# Altium project X98_CARRIER_V1R2.PrjPcb (part 3 of 3)

## Sheet 04 Custom.SchDoc
size A3; SheetNumber: 3; SheetTotal: 15; SPICEModelCacheQCWDKNHH: <root> / <DocumentId>QCWDKNHH</DocumentId> / <CacheFrame Number="0"> / <Model Name="pnp" Kind="MDL"> / <Text>*Default PNP BJT / *PNP Trans Pinout: C,B,E / .MODEL PNP PNP()</Text> / </Model> / </CacheFrame> / </root>
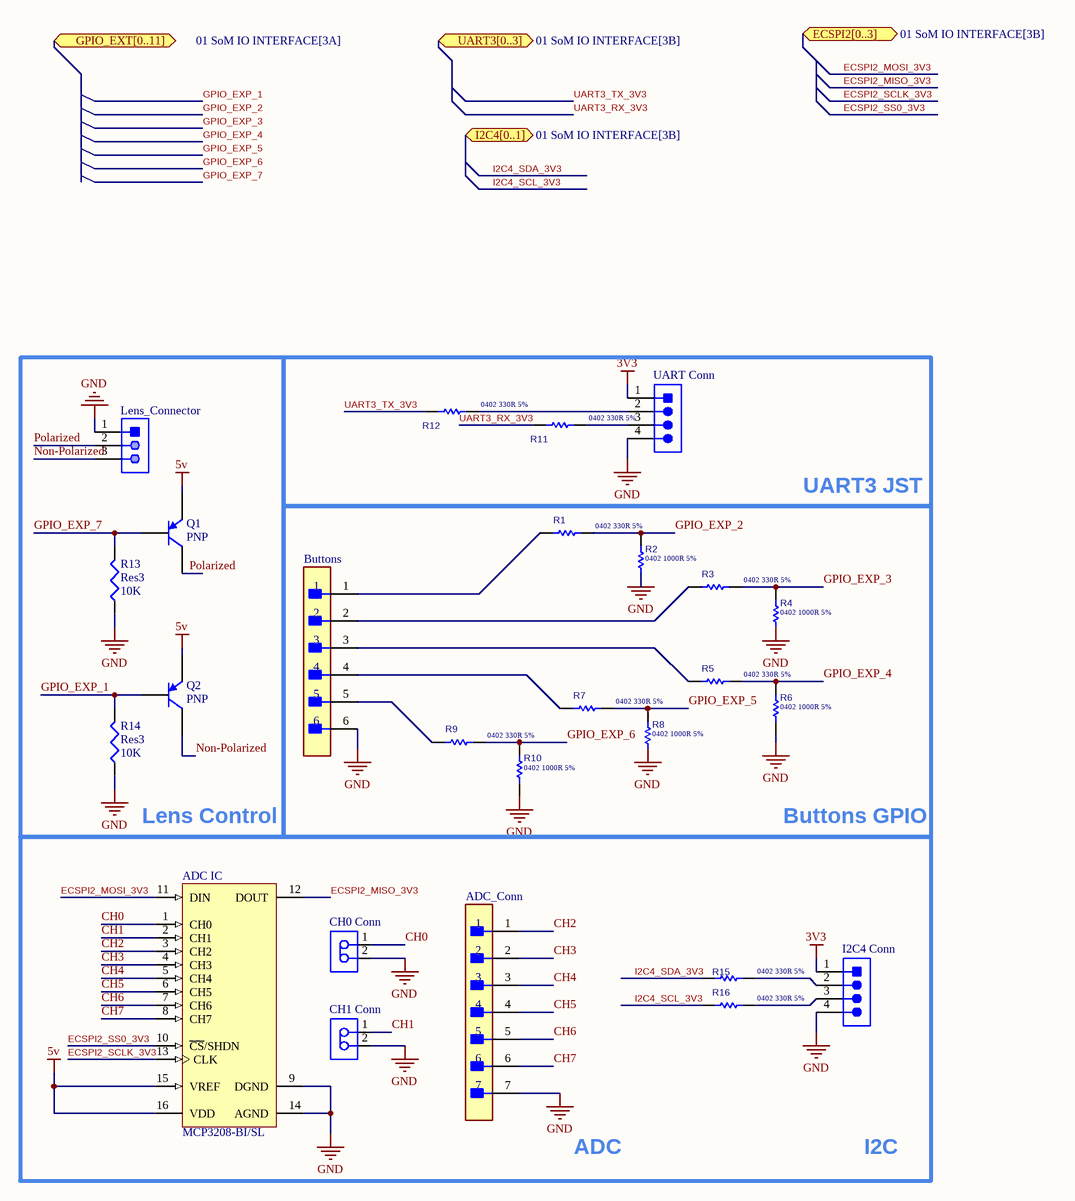
[diagram p13: 04 Custom.SchDoc]

### Parts
ADC_Conn  S7B-PH-K-S(LF)(SN)  [FP-S7B-PH-K-S_LF_SN-MFG]  (value not drawn)
ADC_IC  MCP3208-BI/SL  [SOIC-SL16_L]
Buttons  S6B-ZR(LF)(SN)  [FP-S6B-ZR_LF_SN-MFG]  (value not drawn)
CH0_Conn  B2B-PH-K-S(LF)(SN)  [JST-B2B-PH-K-S_V]  (value not drawn)
CH1_Conn  B2B-PH-K-S(LF)(SN)  [JST-B2B-PH-K-S_V]  (value not drawn)
I2C4_Conn  B4B-PH-K-S(LF)(SN)  [JST-B4B-PH-K-S_V]  (value not drawn)
Lens_Connector  B3B-PH-K-S(LF)(SN)  [JST-B3B-PH-K-S-3_V]  (value not drawn)
Q1  PNP  [SOT-23B_N]
Q2  PNP  [SOT-23B_N]
R1  0402 330R 5%  [0402_RES]
R2  0402 1000R 5%  [0402_RES]
R3  0402 330R 5%  [0402_RES]
R4  0402 1000R 5%  [0402_RES]
R5  0402 330R 5%  [0402_RES]
R6  0402 1000R 5%  [0402_RES]
R7  0402 330R 5%  [0402_RES]
R8  0402 1000R 5%  [0402_RES]
R9  0402 330R 5%  [0402_RES]
R10  0402 1000R 5%  [0402_RES]
R11  0402 330R 5%  [0402_RES]
R12  0402 330R 5%  [0402_RES]
R13  Res3  value 10K  [J1-0603]
R14  Res3  value 10K  [J1-0603]
R15  0402 330R 5%  [0402_RES]
R16  0402 330R 5%  [0402_RES]
UART_Conn  B4B-PH-K-S(LF)(SN)  [JST-B4B-PH-K-S_V]  (value not drawn)

### Blocks framed on the sheet
Lens Control: Lens_Connector Q1 Q2 R13 R14
UART3 JST: R11 R12 UART_Conn
Buttons GPIO: Buttons R1-R10

### Ports
ECSPI2[0..3] (bidir, see 01 SoM IO INTERFACE[3B]), GPIO_EXT[0..11] (bidir, see 01 SoM IO INTERFACE[3A]), I2C4[0..1] (bidir, see 01 SoM IO INTERFACE[3B]), UART3[0..3] (bidir, see 01 SoM IO INTERFACE[3B])

### Nets
3V3: I2C4_Conn.1 UART_Conn.1
5v: ADC_IC.15(VREF) ADC_IC.16(VDD) Q1.3(E) Q2.3(E)
GND: ADC_Conn.7 ADC_IC.9(DGND) ADC_IC.14(AGND) Buttons.6 CH0_Conn.2 CH1_Conn.2 I2C4_Conn.4 Lens_Connector.1 R2.1 R6.1 R10.1 R13.1 R14.1 UART_Conn.4
CH0: ADC_IC.1(CH0) CH0_Conn.1
CH1: ADC_IC.2(CH1) CH1_Conn.1
CH2: ADC_Conn.1 ADC_IC.3(CH2)
CH3: ADC_Conn.2 ADC_IC.4(CH3)
CH4: ADC_Conn.3 ADC_IC.5(CH4)
CH5: ADC_Conn.4 ADC_IC.6(CH5)
CH6: ADC_Conn.5 ADC_IC.7(CH6)
CH7: ADC_Conn.6 ADC_IC.8(CH7)
ECSPI2_MISO_3V3: ADC_IC.12(DOUT)
ECSPI2_MOSI_3V3: ADC_IC.11(DIN)
ECSPI2_SCLK_3V3: ADC_IC.13(CLK)
ECSPI2_SS0_3V3: ADC_IC.10(~{CS}/SHDN)
GPIO_EXP_1: Q2.2(B) R14.2
GPIO_EXP_2: R1.2 R2.2
GPIO_EXP_3: R3.2 R4.2
GPIO_EXP_4: R5.2 R6.2
GPIO_EXP_5: R7.2 R8.2
GPIO_EXP_6: R9.2 R10.2
GPIO_EXP_7: Q1.2(B) R13.2
I2C4_SCL_3V3: R16.1
I2C4_SDA_3V3: R15.1
Non-Polarized: Lens_Connector.3 Q2.1(C)
Polarized: Lens_Connector.2 Q1.1(C)
UART3_RX_3V3: R11.1
UART3_TX_3V3: R12.1
NetButtons_1: Buttons.1 R1.1
NetButtons_2: Buttons.2 R3.1
NetButtons_3: Buttons.3 R5.1
NetButtons_4: Buttons.4 R7.1
NetButtons_5: Buttons.5 R9.1
NetI2C4_Conn_2: I2C4_Conn.2 R15.2
NetI2C4_Conn_3: I2C4_Conn.3 R16.2
NetR11_2: R11.2 UART_Conn.3
NetR12_2: R12.2 UART_Conn.2

Not connected (* = marked no-connect by the designer): R4 1; R8 1

### Notes on the sheet
- ADC
- I2C
- Labels drawn without touching a wire or pin: GND

### Library data of the parts
ADC_Conn = CMP-17439-000222-1: CONN HEADER R/A 7POS 2MM; Number of Contacts: 7; Contact Resistance: 20mR; Gender: Male; Max Voltage Rating (AC): 100V; Max Current Rating: 2A; Insulation Resistance: 1GR; Fastening Type: Detent; Contact Shape: Square; Depth: 7.6mm; Lead Pitch: 2mm; Flammability Rating: UL94 V-0; Housing Material: Polyamide; Series: PH; Lead Free: Lead Free; Height: 9.4mm; REACH SVHC: No SVHC; Contact Type: Male Pin; Contact Finish - Mating: TIN; Contact Material: Brass; Termination: Solder; Insulation Color: Natural; Contact Mating Length: 0.13inch; Insulation Material: Nylon; Number of Positions: 7; Min Operating Temperature: -25°C; Working Voltage: 100V; Contact Plating: Tin; Length: 15.9mm; Current Rating: 2A; Voltage Rating (AC): 100V; Width: 4.5mm; Mount: Through Hole; Voltage Rating: 100V; Number of Poles: 7; Number of Rows: 1; Orientation: Right Angle; Number of Pins: 7; Pitch: 2mm; Housing Color: White; Max Operating Temperature: 85°C; Packaging: Bulk; Color: Natural; Connector Type: Header
ADC_IC = CMP-0188-00427-2: 2.7V 4-Channel/8-Channel 12-Bit A/D Converters with SPI Serial Interface, 16-Pin SOIC 150mil, B Performance Grade, Industrial Temperature; ComponentLink3URL: http://www.microchip.com/stellent/groups/techpub_sg/documents/packagingspec/en012702.pdf; PackageReference: SOIC-SL16; Code_JEDEC: MS-012-AC; ComponentLink1URL: http://www.microchip.com/; ComponentLink2Description: Datasheet; ComponentLink3Description: Package Specification; ComponentLink1Description: Manufacturer URL; DatasheetVersion: revE, Sep-2008; PackageVersion: revBB, Aug-2009; PackageDescription: 16-Lead Plastic Small Outline (SL) - Narrow, 3.90mm Body [SOIC]; RevisionNote: URLs added.; ComponentLink2URL: http://ww1.microchip.com/downloads/en/DeviceDoc/21298e.pdf; Code_IPC: SOIC127P600-16
Buttons = CMP-17439-000122-1: CONN HEADER R/A 6POS 1.5MM; Body Plating: Tin; Contact Resistance: 30mR; Voltage Rating (DC): 50V; Number of Positions: 6; Current Rating: 1A; Panel Thickness: 3.5mm; Insulation Resistance: 500MR; Gender: Male; Lead Free: Lead Free; Contact Shape: Circular; Material: Nylon; Number of Rows: 1; Fastening Type: Detent; Number of Pins: 6; Color: White; Flammability Rating: UL94 V-0; Series: ZH; Depth: 6mm; Termination: Solder; Length: 10.5mm; Lead Pitch: 1.5mm; Min Operating Temperature: -25°C; Width: 3.5mm; Max Operating Temperature: 85°C; Contact Material: Brass; Packaging: Bulk; Insulation Material: Nylon; Height: 7.2mm; Voltage Rating: 50V; Mount: Through Hole; Contact Mating Length: 0.094inch; Max Current Rating: 1A; Insulation Color: Natural; Voltage Rating (AC): 50V; Contact Type: Male Pin; Contact Finish - Mating: TIN; Pitch: 1.5mm; Number of Contacts: 6; Housing Color: Beige; REACH SVHC: No SVHC; Connector Type: Header; Orientation: Right Angle; Max Voltage Rating (AC): 50V; Housing Material: Polyamide; Contact Plating: Tin
CH0_Conn CH1_Conn = CMP-2000-05162-1: Male Header, Pitch 2 mm, 1 x 2 Position, Height 6 mm, Tail Length 3.4 mm, -25 to 85 degC, RoHS, Bulk; Manufacturer: JST; Pitch: 2mm; Style/Orientation: StraightHeader/Plug; No of Positions: 2; Datasheet Version: Nov-08; Datasheet URL: http://datasheet.octopart.com/B2B-PH-K-S%28LF%29%28SN%29-JST-datasheet-8324864.pdf; Manufacturer URL: http://www.jst.com/home2.html; Type: ShroudedHeader; Termination: Crimp
I2C4_Conn UART_Conn = CMP-2000-05165-1: Male Header, Pitch 2 mm, 1 x 4 Position, Height 6 mm, Tail Length 3.4 mm, -25 to 85 degC, RoHS, Bulk; Manufacturer: JST; No of Positions: 4; Style/Orientation: StraightHeader/Plug; Pitch: 2mm; Datasheet URL: http://datasheet.octopart.com/B4B-PH-K-S%28LF%29%28SN%29-JST-datasheet-10558886.pdf; Type: ShroudedHeader; Manufacturer URL: http://www.jst.com/home2.html; Termination: Crimp; Datasheet Version: Apr-09
Lens_Connector = CMP-2000-05164-1: Male Header, Pitch 2 mm, 1 x 3 Position, Height 6 mm, Tail Length 3.4 mm, -25 to 85 degC, RoHS, Bulk; Manufacturer: JST; Style/Orientation: StraightHeader/Plug; Pitch: 2mm; No of Positions: 3; Termination: Crimp; Manufacturer URL: http://www.jst.com/home2.html; Datasheet Version: Oct-06; Type: ShroudedHeader; Datasheet URL: https://datasheet.ciiva.com/11746/0900766b80826550-11746939.pdf
Q1 Q2 = PNP: PNP Bipolar Transistor; Published: 8-Jun-2000; LatestRevisionDate: 29-May-2009; LatestRevisionNote: IPC-7351 Footprint Added.; PackageVersion: Aug-1999; PackageReference: SOT-23B; Publisher: Altium Limited; PackageDescription: 3-Pin SOT-23 Package 0.95 mm Pitch, 2.4 mm Lead Span
R1-R12 R15 R16 = RES-CRGCQ0402J330R: 330 ±5% 0.063W, 1/16W Chip Resistor 0402 (1005 Metric) Automotive AEC-Q200, Moisture Resistant Thick Film; Manufacturer-1: TE Connectivity Passive Product; Opt. Temp.: -55°C ~ 155°C; Tolerance: %5; Manufacturer Part Number-1: CRGCQ0402J330R; Footprint: 0402; Manufacturer-2: *; Manufacturer Part Number-2: *; Inventron Stock No: *; Created By: E.E; Created Date: 23.10.2020; Checked By: *; ASSY_OPT: *; Dimensions: *; Unit Price: *; Revision Date/Note: *; Price Break: *; Class: Resistor
R13 R14 = Res3: Resistor; Published: 8-Jun-2000; LatestRevisionDate: 29-May-2009; LatestRevisionNote: IPC-7351 Footprint Added.; PackageReference: J1-0603; Publisher: Altium Limited; PackageDescription: Chip Resistor

## Sheet 09 USB HUB.SchDoc
size A3; SheetNumber: 5; SheetTotal: 10
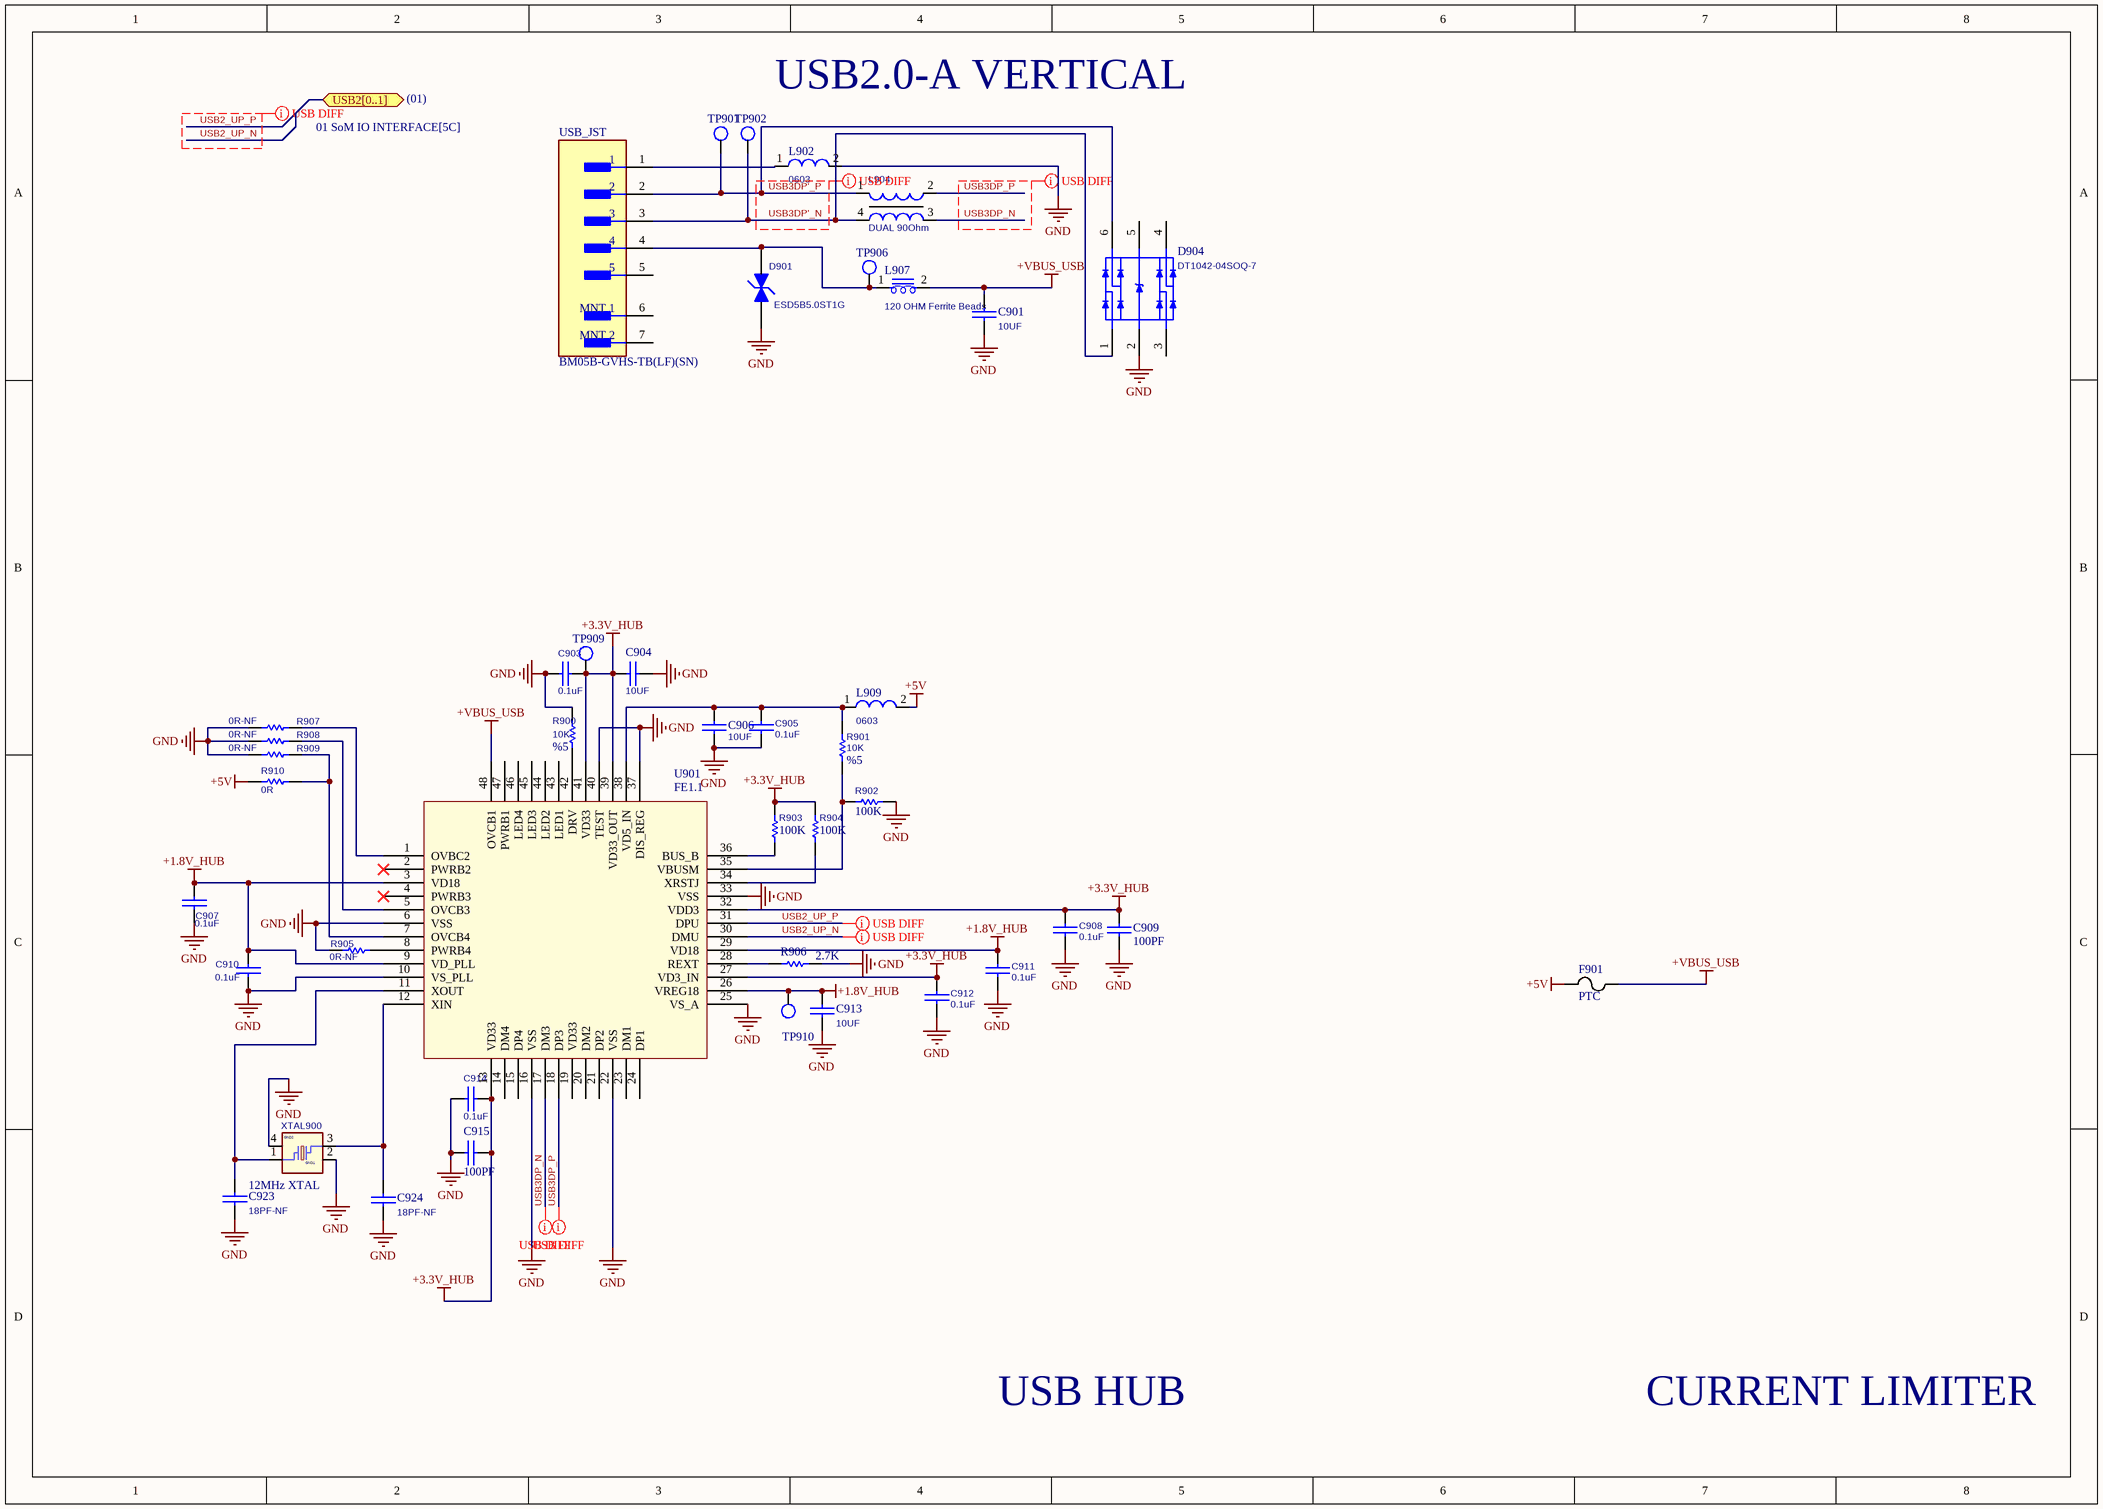
[diagram p14: 09 USB HUB.SchDoc]

### Parts
C901  10UF  [0805]
C903  0.1uF  [0402_CC]
C904  10UF  [0805]
C905  0.1uF  [0402_CC]
C906  10UF  [0805]
C907  0.1uF  [0402_CC]
C908  0.1uF  [0402_CC]
C909  100PF  [0402_CC]
C910  0.1uF  [0402_CC]
C911  0.1uF  [0402_CC]
C912  0.1uF  [0402_CC]
C913  10UF  [0805]
C914  0.1uF  [0402_CC]
C915  100PF  [0402_CC]
C923  18PF-NF  [0402_CC]  (no BOM)
C924  18PF-NF  [0402_CC]  (no BOM)
D901  ESD5B5.0ST1G  [SOD523 - SZESD]
D904  DT1042-04SOQ-7  [DIODE-DT1042-04SOQ-7]
F901  PTC  [1812]
L902  0603  [0603_RES]
L904  DUAL 90Ohm  [DLW21H]
L907  120 OHM Ferrite Beads  [0603_RES]
L909  0603  [0603_RES]
R900  10K  Tolerance: %5  [0402_RES]
R901  10K  Tolerance: %5  [0402_RES]
R902  100K  [0402_RES]
R903  100K  [0402_RES]
R904  100K  [0402_RES]
R905  0R-NF  [0402_RES]  (no BOM)
R906  2.7K  [0402_RES]
R907  0R-NF  [0402_RES]  (no BOM)
R908  0R-NF  [0402_RES]  (no BOM)
R909  0R-NF  [0402_RES]  (no BOM)
R910  0R  [0402_RES]
TP901  TEST POINT 15  [testpoint_15]  (value not drawn)  (no BOM)
TP902  TEST POINT 15  [testpoint_15]  (value not drawn)  (no BOM)
TP906  TEST POINT 15  [testpoint_15]  (value not drawn)  (no BOM)
TP909  TEST POINT 15  [testpoint_15]  (value not drawn)  (no BOM)
TP910  TEST POINT 15  [testpoint_15]  (value not drawn)  (no BOM)
U901  FE1.1  [LQFP48]
USB_JST  BM05B-GVHS-TB(LF)(SN)  [FP-BM05B-GVHS-TB_LF_SN-MFG]
XTAL900  CRYSTAL 12.MHZ 18PF SMD  [XTLOSC4_3P2X2P5MM_SM]  (value not drawn)

### Ports
USB2[0..1] (bidir, see 01 SoM IO INTERFACE[5C])

### Nets
+1.8V_HUB: C907.1 C910.1 C911.2 C913.1 TP910.1 U901.3(VD18) U901.9(VD_PLL) U901.26(VREG18) U901.29(VD18)
+3.3V_HUB: C903.1 C904.1 C908.2 C909.2 C912.2 C914.2 C915.2 R903.2 R904.2 TP909.1 U901.13(VD33) U901.27(VD3_IN) U901.32(VDD3) U901.39(VD33_OUT) U901.41(VD33)
+5V: F901.1 L909.2 R910.2
+VBUS_USB: C901.1 F901.2 L907.2 U901.48(OVCB1)
GND: C901.2 C903.2 C904.2 C905.1 C906.1 C907.2 C908.1 C909.1 C910.2 C911.1 C912.1 C913.2 C914.1 C915.1 C923.2 C924.2 D901.1(A) D904.2(VSS) L902.2 R900.1 R902.1 R905.1 R906.2 R907.1 R908.1 R909.1 U901.6(VSS) U901.10(VS_PLL) U901.16(VSS) U901.22(VSS) U901.25(VS_A) U901.33(VSS) U901.37(DIS_REG) U901.40(TEST) XTAL900.2(GND1) XTAL900.4(GND2)
USB2_UP_N: U901.30(DMU)
USB2_UP_P: U901.31(DPU)
USB3DP'_N: D904.1(IO1) L904.4 TP902.1 USB_JST.3
USB3DP'_P: D904.6(IO4) L904.1 TP901.1 USB_JST.2
USB3DP_N: L904.3 U901.17(DM3)
USB3DP_P: L904.2 U901.18(DP3)
NetC905_2: C905.2 C906.2 L909.1 R901.2 U901.38(VD5_IN)
NetC923_1: C923.1 U901.11(XOUT) XTAL900.1
NetC924_1: C924.1 U901.12(XIN) XTAL900.3
NetD901_2: D901.2(K) L907.1 TP906.1 USB_JST.4
NetL902_1: L902.1 USB_JST.1
NetR900_2: R900.2 U901.42(DRV)
NetR901_1: R901.1 R902.2 U901.35(VBUSM)
NetR903_1: R903.1 U901.36(BUS_B)
NetR904_1: R904.1 U901.34(XRSTJ)
NetR905_2: R905.2 U901.8(PWRB4)
NetR906_1: R906.1 U901.28(REXT)
NetR907_2: R907.2 U901.1(OVBC2)
NetR908_2: R908.2 U901.5(OVCB3)
NetR909_2: R909.2 R910.1 U901.7(OVCB4)

Not connected (* = marked no-connect by the designer): D904 3(IO2) 4(IO3) 5(VCC); U901 2(PWRB2)* 4(PWRB3)* 14(DM4) 15(DP4) 19(VD33) 20(DM2) 21(DP2) 23(DM1) 24(DP1) 43(LED1) 44(LED2) 45(LED3) 46(LED4) 47(PWRB1); USB_JST 5 6(MNT_1) 7(MNT_2)

### Layout directives
differential pair; differential pair class USB 90 OHM DIFF; net class USB: USB2_UP_N, USB2_UP_P, USB3DP'_N, USB3DP'_P, USB3DP_N, USB3DP_P
differential pair; differential pair class USB 90 OHM DIFF; net class USB; net class USB: USB3DP_N, USB3DP_P

### Notes on the sheet
- (01)
- USB2.0-A VERTICAL
- 12MHz XTAL
- USB HUB
- CURRENT LIMITER
- Sheet Title:
- Inventron
- Size:
- Drawn By:
- Revision:
- Project:
- Checked By:
- A4
- Sheet
- of
- Budotek Teknopark
- Dudullu OSB
- Des 2. Cadde No:8/30
- Umraniye / ISTANBUL
- Electronics and Software
- Date:
- Time:
- ©2020 Inventron Electronics and Software. All rights reserved.

### Library data of the parts
C901 C904 C906 C913 = CAP-CL21A106KOQNNNG: CAP CER 10UF 16V X5R 0805; Manufacturer-1: SAMSUNG; Class: Capacitor; Manufacturer Part Number-1: CL21A106KOQNNNG; Footprint: *; Manufacturer-2: *; Manufacturer Part Number-2: *; Inventron Stock No: *; Created By: EE; Created Date: *; Checked By: *; ASSY_OPT: *; Dimensions: *; Unit Price: 0.01876; Revision Date/Note: *; Price Break: 3000; Opt. Temp.: *; Features: *
C903 C905 C907 C908 C910-C912 C914 = CAP-CL05B104KO5NNNC: CAP VER 0.1UF 16V X7R 0402; Manufacturer-1: SAMSUNG; Opt. Temp.: -55/+125; Class: Capacitor; Manufacturer Part Number-1: CL05B104KO5NNNC; Footprint: 0402; Manufacturer-2: *; Manufacturer Part Number-2: *; Inventron Stock No: *; Created By: LA; Created Date: 23.11.2018; Checked By: *; ASSY_OPT: *; Dimensions: *; Unit Price: 0,00499; Revision Date/Note: *; Price Break: 10K
C909 C915 = CAP-CC0402JRNPO9BN101: CAP CER 100PF 50V C0G/NPO 0402; Manufacturer-1: Yageo; Class: Capacitor; Manufacturer Part Number-1: CC0402JRNPO9BN101; Footprint: *; Manufacturer-2: *; Manufacturer Part Number-2: *; Inventron Stock No: *; Created By: *; Created Date: *; Checked By: *; ASSY_OPT: *; Dimensions: *; Unit Price: *; Revision Date/Note: *; Price Break: *; Opt. Temp.: *; Features: *
C923 C924 = CAP-GCM1555C1H180JA16D: CAP CER 18PF 50V C0G/NP0 0402; Manufacturer-1: Murata Electronics; Class: Capacitor; Manufacturer Part Number-1: GCM1555C1H180JA16D; Footprint: *; Manufacturer-2: *; Manufacturer Part Number-2: *; Inventron Stock No: *; Created By: *; Created Date: *; Checked By: *; ASSY_OPT: *; Dimensions: *; Unit Price: *; Revision Date/Note: *; Price Break: *; Opt. Temp.: *; Features: *
D901 = DIODE-ESD5B5.0ST1G: VS DIODE 5V SOD523; Manufacturer-1: ON Semiconductor; Opt. Temp.: -55/+150; Manufacturer Part Number-1: ESD5B5.0ST1G; Footprint: SOD-523; Manufacturer-2: *; Manufacturer Part Number-2: *; Inventron Stock No: *; Created By: E.E; Created Date: 3.11.2020; Checked By: *; ASSY_OPT: *; Dimensions: *; Unit Price: 0,0129; Revision Date/Note: *; Price Break: 3000; Class: Diode; Features: AUTOMOTIVE
D904 = DIODE-DT1042-04SOQ-7: HDMI TVS DIODE; Manufacturer-1: Diodes Incorporated; Opt. Temp.: -55°C ~ 85°C (TA); Manufacturer Part Number-1: DT1042-04SOQ-7; Footprint: SOT26; Manufacturer-2: *; Manufacturer Part Number-2: *; Inventron Stock No: *; Created By: E.E; Created Date: 23.10.2020; Checked By: *; ASSY_OPT: *; Dimensions: *; Unit Price: 0.07575; Revision Date/Note: *; Price Break: 3000; Class: Diode
F901 = FUSE-KMC5S110RY33: THERMISTOR PTC RESETTABLE FUSE 1206 1100mA 33V 1812; Manufacturer-1: THINKING; Manufacturer Part Number-1: KMC5S110RY33; Manufacturer-2: *; Manufacturer Part Number-2: *; Inventron Stock No: *; Created By: EE; Created Date: *; Checked By: *; ASSY_OPT: *; Dimensions: *; Unit Price: 0.083; Revision Date/Note: *; Price Break: 4000; Opt. Temp.: *; Class: FUSE
L902 L909 = IND-FERRITE (RES 0 OHM) 0603: 0OHM 0603; Manufacturer Part Number-1: RC0603JR-070RL; Manufacturer-1: YAGEO; Class: Inductor; Footprint: 0603; Manufacturer-2: *; Inventron Stock No: *; Created By: EE; Checked By: *; ASSY_OPT: *; Dimensions: *; Revision Date/Note: *
L904 = IND-DLW21HN900SQ2L: Common Mode Chokes Dual 90Ohm 100MHz 0.33A 0.35Ohm DCR SMD T/R; Manufacturer-1: Murata Manufacturing; Class: Inductor; Manufacturer Part Number-1: DLW21HN900SQ2L; Footprint: *; Manufacturer-2: *; Manufacturer Part Number-2: *; Inventron Stock No: *; Created By: E.E; Created Date: 2.11.2020; Checked By: *; ASSY_OPT: *; Dimensions: *; Unit Price: 0.185; Revision Date/Note: *; Price Break: 3000; Opt. Temp.: *; Features: *
L907 = IND-BLM18PG121SH1D: Ferrite Beads Multi-Layer 120Ohm 25% 100MHz 2A 0.05Ohm DCR 0603 Automotive T/R; Manufacturer-1: Murata Manufacturing; Class: Inductor; Manufacturer Part Number-1: BLM18PG121SH1D; Footprint: 0603; Manufacturer-2: *; Manufacturer Part Number-2: *; Inventron Stock No: *; Created By: E.E; Created Date: 2.11.2020; Checked By: *; ASSY_OPT: *; Dimensions: *; Unit Price: 0.02550; Revision Date/Note: *; Price Break: 4000; Opt. Temp.: *; Features: *
R900 R901 = RES-RMCF0402JT10K0: RES 10K OHM 5% 1/16W 0402; Manufacturer-1: STACKPOLE; Opt. Temp.: -55/+155; Class: Resistor; Manufacturer Part Number-1: RMCF0402JT10K0; Footprint: 0402; Manufacturer-2: *; Manufacturer Part Number-2: *; Inventron Stock No: *; Created By: LA; Created Date: 23.11.2018; Checked By: *; ASSY_OPT: *; Dimensions: *; Unit Price: 0,00127; Revision Date/Note: *; Price Break: 10K
R902-R904 = RES-RMCF0402JT100K: RES 100K OHM 5% 1/16W 0402; Manufacturer-1: STACKPOLE; Opt. Temp.: -55/+155; Class: Resistor; Tolerance: %5; Manufacturer Part Number-1: RMCF0402JT100K; Footprint: 0402; Manufacturer-2: *; Manufacturer Part Number-2: *; Inventron Stock No: *; Created By: LA; Created Date: 23.11.2018; Checked By: *; ASSY_OPT: *; Dimensions: *; Unit Price: 0,00127; Revision Date/Note: *; Price Break: 10K; Features: AUTOMOTIVE
R905 R907-R910 = RES-RMCF0402ZT0R00: RES 0 OHM JUMPER 1/16W 0402; Manufacturer-1: STACKPOLE; Opt. Temp.: -55/+155; Class: Resistor; Manufacturer Part Number-1: RMCF0402ZT0R00; Footprint: 0402; Manufacturer-2: *; Manufacturer Part Number-2: *; Inventron Stock No: *; Created By: LA; Created Date: 23.11.2018; Checked By: *; ASSY_OPT: *; Dimensions: *; Unit Price: 0,00127; Revision Date/Note: *; Price Break: 10K
R906 = RES-RMCF0402FT2K70: RES SMD 2.7K OHM 1% 1/16W 0402; Manufacturer-1: Yageo; Class: Resistor; Manufacturer Part Number-1: RMCF0402FT2K70; Footprint: 0402; Manufacturer-2: *; Manufacturer Part Number-2: *; Inventron Stock No: *; Created By: EE; Created Date: *; Checked By: *; ASSY_OPT: *; Dimensions: *; Unit Price: *; Revision Date/Note: *; Price Break: *; Opt. Temp.: *; Tolerance: *
U901 = IC-FE1.1-AQFP48A: IC 4XCH USB Hub Controller USB 2.0 USB Interface 48-QFP (7x7); Manufacturer-1: TERMINUS; Class: ICs; Manufacturer Part Number-1: FE1.1-AQFP48A; Footprint: 48 LQFP; Manufacturer-2: *; Manufacturer Part Number-2: *; Inventron Stock No: *; Created By: OKS; Created Date: 03.06.2022; Checked By: *; ASSY_OPT: *; Dimensions: *; Unit Price: 1.05; Revision Date/Note: *; Price Break: 5000; Opt. Temp.: *
USB_JST = CMP-17439-000129-1: CONN HEADER SMD 5POS 1.25MM; Number of Positions: 5; Mated Stacking Heights: 8.8mm; Voltage Rating: 50V; Pitch: 0.049inch; Contact Plating: Tin; Fastening Type: Latch; Insulation Material: Nylon; Contact Type: Outer Shroud Contact; Color: Natural; Contact Shape: Rectangular; Flammability Rating: UL94 V-0; Packaging: Cut Tape; Number of Rows: 1; Contact Finish - Mating: TIN; Termination: Solder; Max Operating Temperature: 85°C; Series: GVH; Min Operating Temperature: -25°C; Mount: Surface Mount; Connector Type: Header; Insulation Color: Natural; Contact Material: Bronze
XTAL900 = XTAL-FA-238V 12.0000MB50X-C0: CRYSTAL 12.0000MHZ 18PF SMD; Manufacturer-1: EPSON; Opt. Temp.: +40/+85; Manufacturer Part Number-1: FA-238V 12.0000MB50X-C0; Footprint: 4-SMD; Manufacturer-2: *; Manufacturer Part Number-2: *; Inventron Stock No: *; Created By: E.E; Created Date: 20.10.2020; Checked By: *; ASSY_OPT: *; Dimensions: *; Unit Price: 0.6; Revision Date/Note: *; Price Break: 1K; Class: Crystal

## Sheet 00 PCB SPEC.SchDoc
size A2
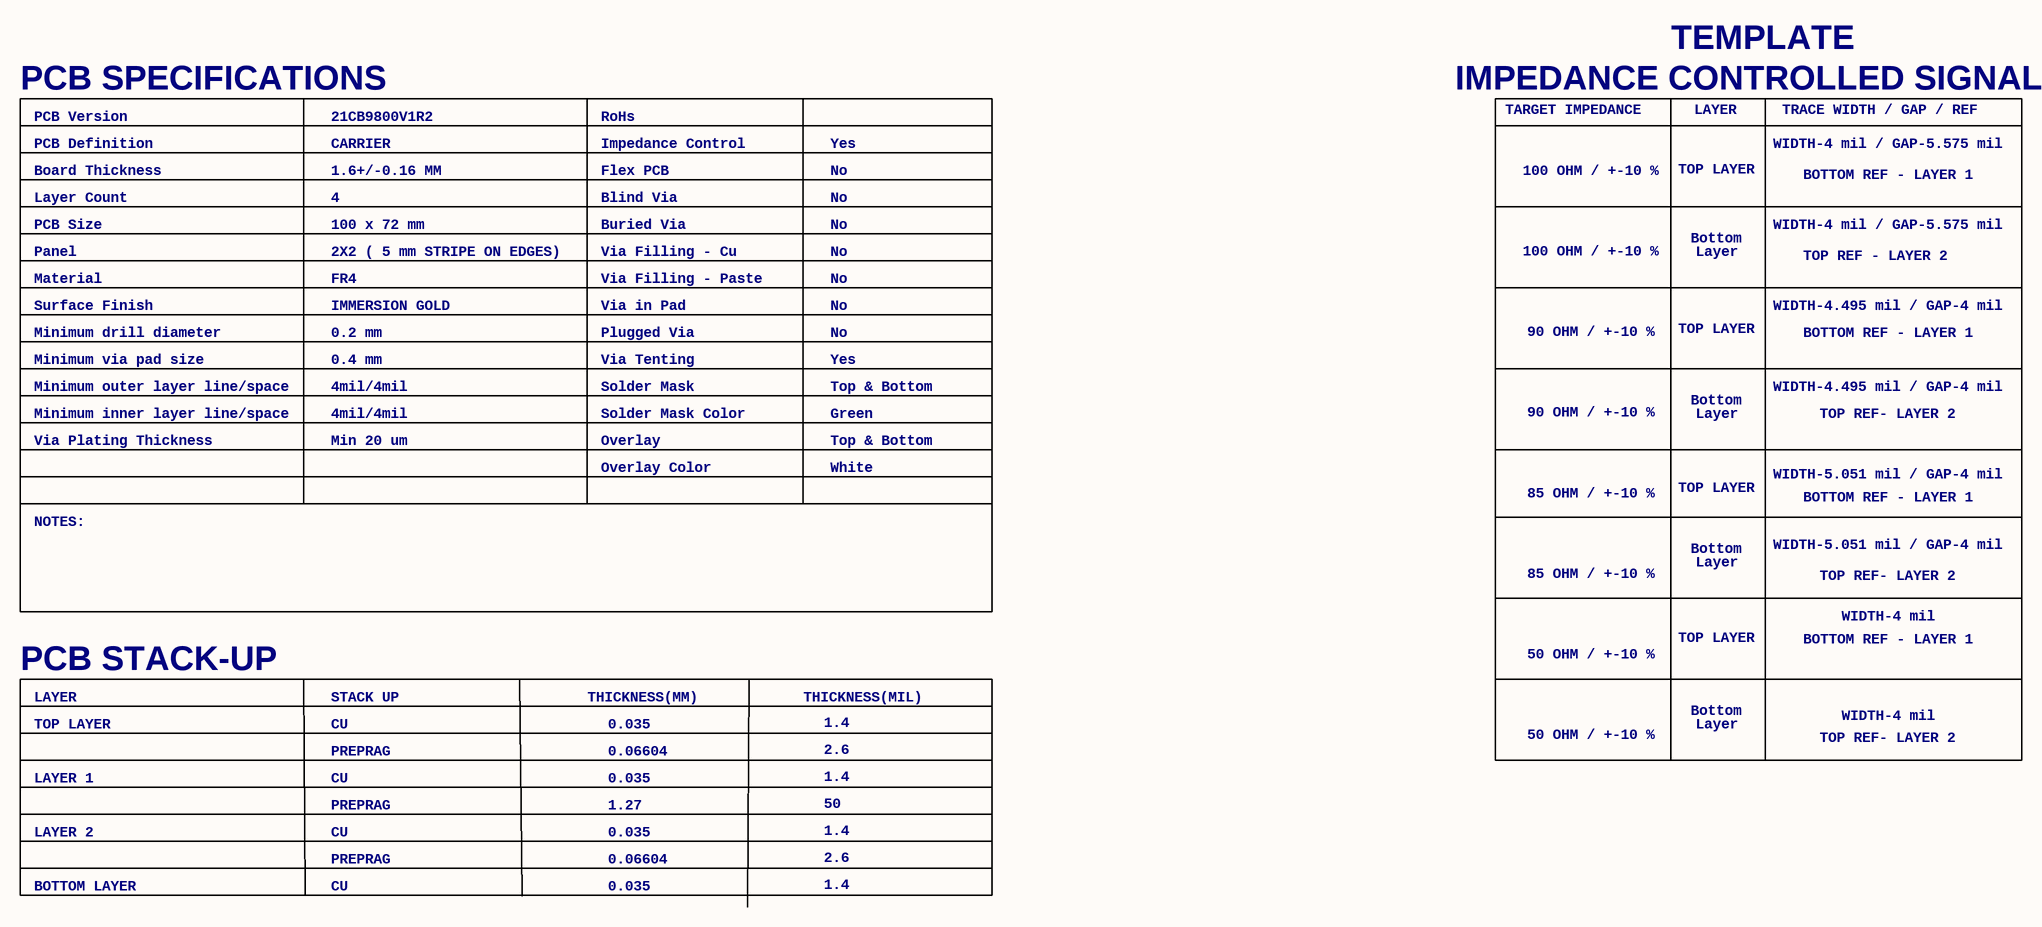
[diagram p15: 00 PCB SPEC.SchDoc]

### Notes on the sheet
- TEMPLATE
- PCB SPECIFICATIONS
- PCB Version
- 21CB9800V1R2
- RoHs
- IMPEDANCE CONTROLLED SIGNALS
- TARGET IMPEDANCE
- LAYER
- TRACE WIDTH / GAP / REF
- Board Thickness
- Layer Count
- PCB Definition
- 1.6+/-0.16 MM
- 4
- CARRIER
- Impedance Control
- Flex PCB
- Blind Via
- Yes
- No
- 100 OHM / +-10 %
- TOP LAYER
- WIDTH-4 mil / GAP-5.575 mil
- BOTTOM REF - LAYER 1
- PCB Size
- Panel
- 100 x 72 mm
- 2X2 ( 5 mm STRIPE ON EDGES)
- Buried Via
- Via Filling - Cu
- Bottom
- Layer
- TOP REF - LAYER 2
- Material
- Minimum drill diameter
- Surface Finish
- FR4
- IMMERSION GOLD
- 0.2 mm
- Via Filling - Paste
- Via in Pad
- Plugged Via
- 90 OHM / +-10 %
- WIDTH-4.495 mil / GAP-4 mil
- Minimum via pad size
- Minimum outer layer line/space
- 0.4 mm
- 4mil/4mil
- Via Tenting
- Solder Mask
- Top & Bottom
- Minimum inner layer line/space
- Via Plating Thickness
- Min 20 um
- Solder Mask Color
- Overlay
- Overlay Color
- Green
- White
- WIDTH-5.051 mil / GAP-4 mil
- TOP REF- LAYER 2
- NOTES:
- 85 OHM / +-10 %
- PCB STACK-UP
- 50 OHM / +-10 %
- WIDTH-4 mil
- STACK UP
- CU
- THICKNESS(MM)
- 0.035
- THICKNESS(MIL)
- 1.4
- LAYER 1
- PREPRAG
- 0.06604
- 1.27
- 2.6
- 50
- LAYER 2
- BOTTOM LAYER
- Sheet Title:
- Project:
- Inventron
- Electronics and Software
- Size:
- Date:
- Drawn By:
- Revision:
- Checked By:
- A4
- Sheet
- Time:
- of
- Budotek Teknopark
- Dudullu OSB
- Des 2. Cadde No:8/30
- ©2020 Inventron Electronics and Software. All rights reserved.
- Umraniye / ISTANBUL

## Nets that join several sheets
+1.8V_VDD: 01 SoM IO INTERFACE (12 pins), 10 BOOT (R1031.1 R1032.1), 06 MIPI-DSI to HDMI (14 pins)
+3.3V_EXT: 07 MIPI CSI (L701.2), 08 USB OTG & POWER (L805.2 Power_JST1.2 Power_JST2.2 TP808.1), 06 MIPI-DSI to HDMI (L607.1)
+3.3V_VDD: 01 SoM IO INTERFACE (17 pins), 10 BOOT (17 pins), 05 MICROSD (C500.1 Q500.2 R500.2), 06 MIPI-DSI to HDMI (6 pins), 12 CONSOLE (L1204.2 L1205.1 R1200.1)
+5V: 01 SoM IO INTERFACE (11 pins), 08 USB OTG & POWER (7 pins), 06 MIPI-DSI to HDMI (7 pins), 12 CONSOLE (L1200.2), 09 USB HUB (F901.1 L909.2 R910.2)
+VBACKUP: 01 SoM IO INTERFACE (CON101.36 TP114.1), 08 USB OTG & POWER (CON801.1 D804.K R806.1)
CHASIS: 08 USB OTG & POWER (CON803.S1 CON803.S2 CON803.S3 CON803.S4), 06 MIPI-DSI to HDMI (CON602.G1 CON602.G2 CON602.G3 CON602.G4)
GND: 01 SoM IO INTERFACE (62 pins), 07 MIPI CSI (10 pins), 08 USB OTG & POWER (21 pins), 10 BOOT (24 pins), 05 MICROSD (9 pins), 06 MIPI-DSI to HDMI (56 pins), 12 CONSOLE (13 pins), 04 Custom (14 pins), 09 USB HUB (36 pins)
+3.3V_EXT_ENABLE: 01 SoM IO INTERFACE (R112.2), 08 USB OTG & POWER (R813.1)
DISP_CON_O1: 01 SoM IO INTERFACE (R113.1), 06 MIPI-DSI to HDMI (CON600.18)
DISP_CON_O2: 01 SoM IO INTERFACE (R116.1), 06 MIPI-DSI to HDMI (CON600.19)
DSI/LVDS_CON_INT: 01 SoM IO INTERFACE (CON100.72), 06 MIPI-DSI to HDMI (Q600.3)
DSI_GPIO: 01 SoM IO INTERFACE (CON100.94), 06 MIPI-DSI to HDMI (R604.1)
ECSPI2_MISO_3V3: 01 SoM IO INTERFACE (CON100.16), 04 Custom (ADC_IC.12)
ECSPI2_MOSI_3V3: 01 SoM IO INTERFACE (CON100.18), 04 Custom (ADC_IC.11)
ECSPI2_SCLK_3V3: 01 SoM IO INTERFACE (CON100.14), 04 Custom (ADC_IC.13)
ECSPI2_SS0_3V3: 01 SoM IO INTERFACE (CON100.12), 04 Custom (ADC_IC.10)
GPIO_EXP_1: 01 SoM IO INTERFACE (CON101.54), 04 Custom (Q2.2 R14.2)
GPIO_EXP_2: 01 SoM IO INTERFACE (CON101.60), 04 Custom (R1.2 R2.2)
GPIO_EXP_3: 01 SoM IO INTERFACE (CON101.74), 04 Custom (R3.2 R4.2)
GPIO_EXP_4: 01 SoM IO INTERFACE (CON101.56), 04 Custom (R5.2 R6.2)
GPIO_EXP_5: 01 SoM IO INTERFACE (CON101.93), 04 Custom (R7.2 R8.2)
GPIO_EXP_6: 01 SoM IO INTERFACE (CON101.97), 04 Custom (R9.2 R10.2)
GPIO_EXP_7: 01 SoM IO INTERFACE (CON101.58), 04 Custom (Q1.2 R13.2)
HDMI_HPD: 01 SoM IO INTERFACE (CON100.48), 06 MIPI-DSI to HDMI (Q601.2 R627.2 TP603.1 U600.14)
I2C2_SCL_3V3: 01 SoM IO INTERFACE (CON100.22 R100.1 TP100.1), 07 MIPI CSI (R702.2), 06 MIPI-DSI to HDMI (Q602.3 R628.1)
I2C2_SDA_3V3: 01 SoM IO INTERFACE (CON100.24 R102.1 TP101.1), 07 MIPI CSI (R704.2), 06 MIPI-DSI to HDMI (Q602.6 R626.1)
I2C3_SCL_3V3: 01 SoM IO INTERFACE (CON100.30 R103.1 TP102.1), 06 MIPI-DSI to HDMI (CON600.22 Q603.1 R630.1)
I2C3_SDA_3V3: 01 SoM IO INTERFACE (CON100.34 R104.1 TP103.1), 06 MIPI-DSI to HDMI (CON600.23 Q603.4 R634.1)
I2C4_SCL_3V3: 01 SoM IO INTERFACE (CON100.26 R105.1 TP104.1), 07 MIPI CSI (R703.2), 04 Custom (R16.1)
I2C4_SDA_3V3: 01 SoM IO INTERFACE (CON100.28 R106.1 TP105.1), 07 MIPI CSI (R705.2), 04 Custom (R15.1)
IRQ_HDMI: 01 SoM IO INTERFACE (CON101.39), 06 MIPI-DSI to HDMI (U600.63)
MIPI_CSI_CLK_N: 01 SoM IO INTERFACE (CON100.53), 07 MIPI CSI (CON700.5 TP702.1)
MIPI_CSI_CLK_P: 01 SoM IO INTERFACE (CON100.51), 07 MIPI CSI (CON700.6 TP703.1)
MIPI_CSI_D0_N: 01 SoM IO INTERFACE (CON100.59), 07 MIPI CSI (CON700.2 TP700.1)
MIPI_CSI_D0_P: 01 SoM IO INTERFACE (CON100.57), 07 MIPI CSI (CON700.3 TP701.1)
MIPI_CSI_D1_N: 01 SoM IO INTERFACE (CON100.47), 07 MIPI CSI (CON700.8)
MIPI_CSI_D1_P: 01 SoM IO INTERFACE (CON100.45), 07 MIPI CSI (CON700.9)
MIPI_CSI_D2_N: 01 SoM IO INTERFACE (CON100.41), 07 MIPI CSI (CON700.11)
MIPI_CSI_D2_P: 01 SoM IO INTERFACE (CON100.39), 07 MIPI CSI (CON700.12)
MIPI_CSI_D3_N: 01 SoM IO INTERFACE (CON100.35), 07 MIPI CSI (CON700.14)
MIPI_CSI_D3_P: 01 SoM IO INTERFACE (CON100.33), 07 MIPI CSI (CON700.15)
MIPI_DSI_CK_N: 01 SoM IO INTERFACE (CON100.15), 06 MIPI-DSI to HDMI (R641.1 U600.8)
MIPI_DSI_CK_P: 01 SoM IO INTERFACE (CON100.17), 06 MIPI-DSI to HDMI (R639.1 U600.7)
MIPI_DSI_D0_N: 01 SoM IO INTERFACE (CON100.27), 06 MIPI-DSI to HDMI (R607.1 U600.2)
MIPI_DSI_D0_P: 01 SoM IO INTERFACE (CON100.29), 06 MIPI-DSI to HDMI (R605.1 U600.1)
MIPI_DSI_D1_N: 01 SoM IO INTERFACE (CON100.21), 06 MIPI-DSI to HDMI (R637.1 U600.4)
MIPI_DSI_D1_P: 01 SoM IO INTERFACE (CON100.23), 06 MIPI-DSI to HDMI (R635.1 U600.3)
MIPI_DSI_D2_N: 01 SoM IO INTERFACE (CON100.9), 06 MIPI-DSI to HDMI (R645.1 U600.10)
MIPI_DSI_D2_P: 01 SoM IO INTERFACE (CON100.11), 06 MIPI-DSI to HDMI (R643.1 U600.9)
MIPI_DSI_D3_N: 01 SoM IO INTERFACE (CON100.3), 06 MIPI-DSI to HDMI (R649.1 U600.12)
MIPI_DSI_D3_P: 01 SoM IO INTERFACE (CON100.5), 06 MIPI-DSI to HDMI (R647.1 U600.11)
nRESET_HDMI: 01 SoM IO INTERFACE (CON101.41), 06 MIPI-DSI to HDMI (C640.1 R632.1 U600.64)
ONOFF: 01 SoM IO INTERFACE (CON100.46), 10 BOOT (CON1001.1 SW1001.2 TP1001.1)
PWDN_CAM_C: 01 SoM IO INTERFACE (R114.2), 07 MIPI CSI (CON700.17)
PWM1_E: 01 SoM IO INTERFACE (CON100.62), 06 MIPI-DSI to HDMI (CON600.20)
PWM3_E: 01 SoM IO INTERFACE (CON100.66), 07 MIPI CSI (R701.2)
RST_CAM_C: 01 SoM IO INTERFACE (R111.2), 07 MIPI CSI (CON700.23)
SAI1_RXD1: 01 SoM IO INTERFACE (CON101.49 R111.1), 10 BOOT (R1001.1 R1004.2)
SAI1_RXD2: 01 SoM IO INTERFACE (CON101.51 R112.1), 10 BOOT (R1006.1 R1009.2)
SAI1_RXD3: 01 SoM IO INTERFACE (CON101.53 R114.1), 10 BOOT (R1007.1 R1010.2)
SAI1_RXD4: 01 SoM IO INTERFACE (CON101.55), 10 BOOT (R1014.1 R1034.1 R1038.2)
SAI1_RXD5: 01 SoM IO INTERFACE (CON101.57), 10 BOOT (R1019.1 R1036.1 R1040.2)
SAI1_RXD6: 01 SoM IO INTERFACE (CON101.61 R116.2), 10 BOOT (R1008.1 R1011.2)
SAI1_RXD7: 01 SoM IO INTERFACE (CON101.63), 10 BOOT (R1015.1 R1020.2)
SAI1_TXD0: 01 SoM IO INTERFACE (CON101.89), 10 BOOT (R1016.1 R1021.2)
SAI1_TXD1: 01 SoM IO INTERFACE (CON101.65 R113.2), 10 BOOT (R1002.1 R1005.2)
SAI1_TXD2: 01 SoM IO INTERFACE (CON101.67), 10 BOOT (R1013.1 R1033.1 R1037.2)
SAI1_TXD3: 01 SoM IO INTERFACE (CON101.69), 10 BOOT (R1023.1 R1041.1 R1043.2)
SAI1_TXD4: 01 SoM IO INTERFACE (CON101.73), 10 BOOT (R1012.1 R1035.1 R1039.2)
SAI1_TXD5: 01 SoM IO INTERFACE (CON101.75), 10 BOOT (R1024.1 R1042.1 R1044.2)
SAI2_TXC: 01 SoM IO INTERFACE (CON101.42), 06 MIPI-DSI to HDMI (U600.60)
SAI2_TXD: 01 SoM IO INTERFACE (CON101.46), 06 MIPI-DSI to HDMI (U600.58)
SAI2_TXFS: 01 SoM IO INTERFACE (CON101.44), 06 MIPI-DSI to HDMI (U600.59)
SD2_CD_B: 01 SoM IO INTERFACE (CON100.76), 05 MICROSD (R507.1)
SD2_CLK: 01 SoM IO INTERFACE (CON100.82), 05 MICROSD (R510.1)
SD2_CMD: 01 SoM IO INTERFACE (CON100.84), 05 MICROSD (R511.1)
SD2_DATA0: 01 SoM IO INTERFACE (CON100.78), 05 MICROSD (R509.1)
SD2_DATA1: 01 SoM IO INTERFACE (CON100.74), 05 MICROSD (R508.1)
SD2_DATA2: 01 SoM IO INTERFACE (CON100.88), 05 MICROSD (R513.1)
SD2_DATA3: 01 SoM IO INTERFACE (CON100.86), 05 MICROSD (R512.1)
SD2_nRST: 01 SoM IO INTERFACE (CON100.90), 05 MICROSD (Q500.1 R500.1)
SYS_BOOT_MODE0: 01 SoM IO INTERFACE (CON101.45), 10 BOOT (CON1000.5 R1028.2)
SYS_BOOT_MODE1: 01 SoM IO INTERFACE (CON101.43), 10 BOOT (CON1000.7 R1027.2)
SYS_nRST: 01 SoM IO INTERFACE (CON101.33), 10 BOOT (SW1000.3 SW1000.4 TP1000.1)
UART2_RXD: 01 SoM IO INTERFACE (CON101.94), 12 CONSOLE (R1203.1)
UART2_TXD: 01 SoM IO INTERFACE (CON101.96), 12 CONSOLE (R1202.2)
UART3_RX_3V3: 01 SoM IO INTERFACE (CON100.4), 04 Custom (R11.1)
UART3_TX_3V3: 01 SoM IO INTERFACE (CON100.6), 04 Custom (R12.1)
UART4_RXD: 01 SoM IO INTERFACE (CON101.92), 12 CONSOLE (D1203.1 R1210.1)
UART4_TXD: 01 SoM IO INTERFACE (CON101.88), 12 CONSOLE (R1205.2)
USB2_UP_N: 01 SoM IO INTERFACE (CON100.93), 09 USB HUB (U901.30)
USB2_UP_P: 01 SoM IO INTERFACE (CON100.95), 09 USB HUB (U901.31)